# EasyEDA schematic SCH_PCB-Hacker-Jam_2024-06-07.json
TITLE: Sheet_1; REV: 1.0; Date: 2024-02-13; Sheet: 1/1; Drawn By: krishbhav123; Company: Your Company
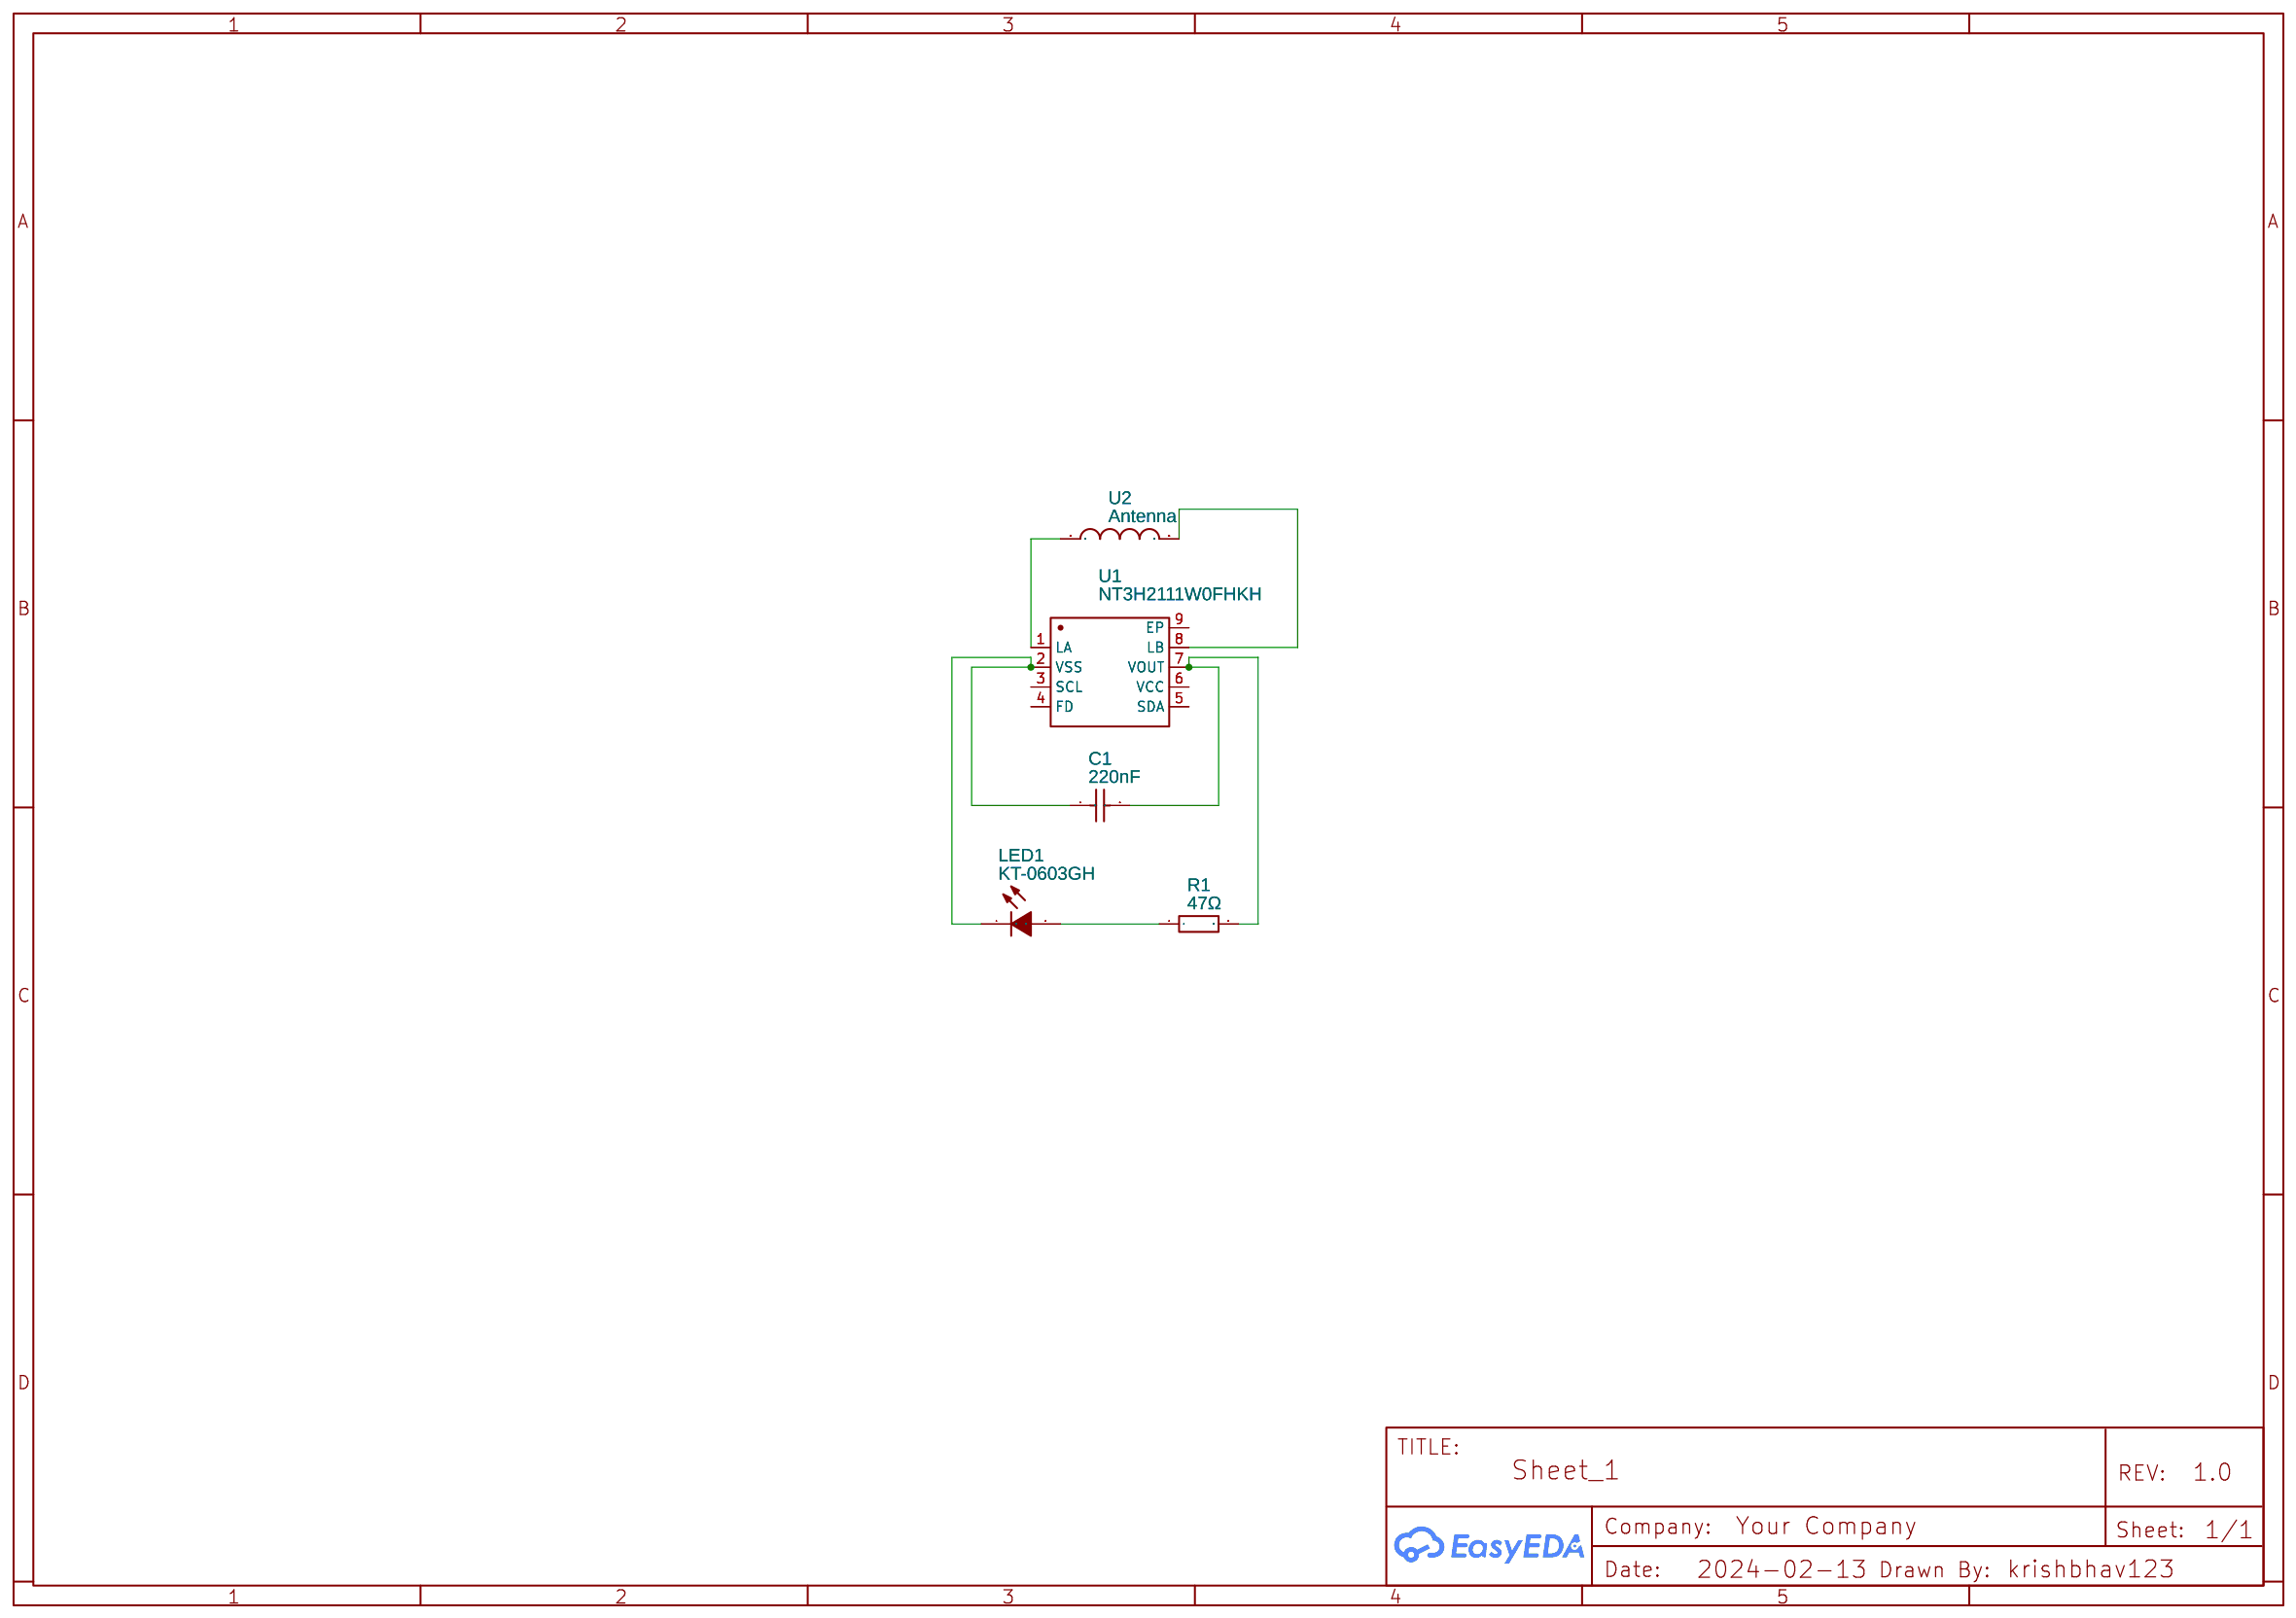
[diagram p0: schematic sheet]

## Parts
C1  220nF  [C0603]
LED1  KT-0603GH  [LED0603-RD_GREEN]
R1  47Ω  [R0603]
U1  NT3H2111W0FHKH  [XQFN-8_L1.6-W1.6-P0.50-BL]
U2  Antenna  [25X48MM_NFC_ANTENNA]

## Library data of the parts
C1 = CL10B224KA8NNNC: Supplier: LCSC; Manufacturer: SAMSUNG(三星); Supplier Part: C21120; JLCPCB Part Class: Basic Part
LED1 = KT-0603GH: Contributor: LCSC; Supplier: LCSC; Supplier Part: C9900005170; Manufacturer: 匡通; JLCPCB Part Class: Extended Part
R1 = 0603WAF470JT5E: Supplier: LCSC; Manufacturer: UNI-ROYAL(厚声); Supplier Part: C23182; JLCPCB Part Class: Basic Part
U1 = NT3H2111W0FHKH: Contributor: LCSC; Supplier: LCSC; Supplier Part: C710403; Manufacturer: NXP(恩智浦); JLCPCB Part Class: Extended Part
U2 = Antenna: Contributor: maggie.j.liu

## Nets
Net-(C1-1): C1.1 LED1.1(C) U1.2(VSS)
Net-(C1-2): C1.2 R1.2 U1.7(VOUT)
Net-(LED1-2): LED1.2(A) R1.1
Net-(U1-1): U1.1(LA) U2.P$2
Net-(U1-8): U1.8(LB) U2.P$1

Not connected (* = marked no-connect by the designer): U1 3(SCL) 4(FD) 5(SDA) 6(VCC) 9(EP)
